# Altium schematic sheet TCA9548A.SchDoc
size A
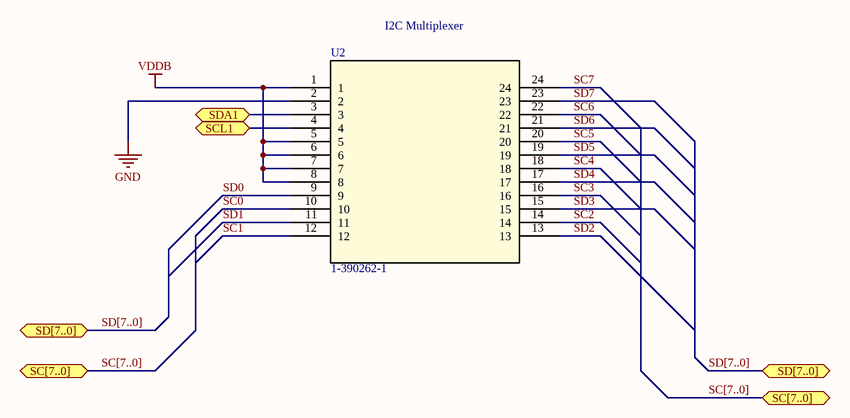
[diagram p0: TCA9548A.SchDoc]

## Parts
U2  1-390262-1  [1-390262-1_TYC]

## Ports
SC[7..0], SCL1, SD[7..0], SDA1

## Nets
GND: U2.2
VDDB: U2.1 U2.5 U2.6 U2.7 U2.8
SC0: U2.10
SC1: U2.12
SC2: U2.14
SC3: U2.16
SC4: U2.18
SC5: U2.20
SC6: U2.22
SC7: U2.24
SCL1: U2.4 ; port SCL1
SD0: U2.9
SD1: U2.11
SD2: U2.13
SD3: U2.15
SD4: U2.17
SD5: U2.19
SD6: U2.21
SD7: U2.23
SDA1: U2.3 ; port SDA1

## Buses and harness runs
bus SC[7..0] = port SC[7..0]
bus SD[7..0] = port SD[7..0]

## Notes on the sheet
- I2C Multiplexer

## Library data of the parts
U2 = 1-390262-1: No Description Available; Mfr_Name: TE Connectivity; Copyright: Copyright (C) 2022 Ultra Librarian. All rights reserved.; Manufacturer_Part_Number: 1-390262-1; RefDes: RefDes; Type: DEV